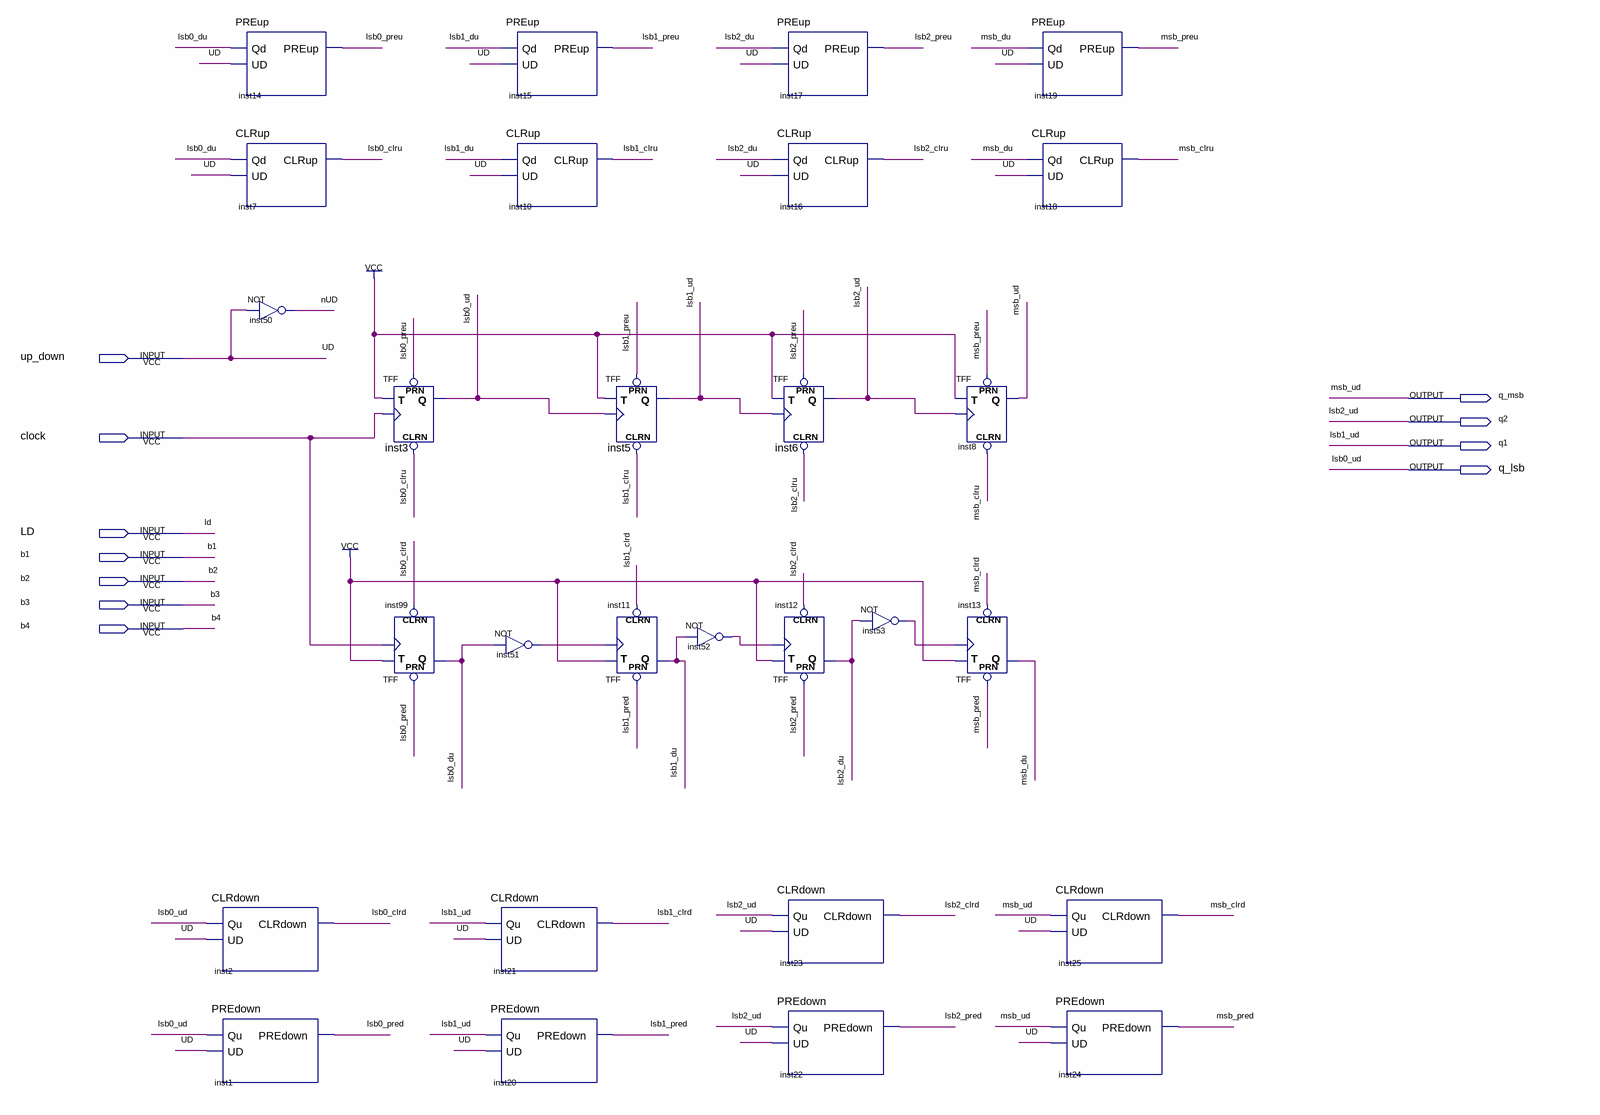
[diagram p0: schematic sheet]
// Quartus schematic up_and_down_counter_box.bdf as structural Verilog: 28 symbols, 11 pins
module up_and_down_counter_box (
  input  up_down,
  input  clock,
  input  LD,
  input  b1,
  input  b2,
  input  b3,
  input  b4,
  output q_msb,
  output q2,
  output q1,
  output q_lsb
);

  wire inst51_out, inst52_out, inst53_out, lsb0_clrd, lsb0_clru, lsb0_du, lsb0_pred, lsb0_preu, lsb1_clrd,
       lsb1_clru, lsb1_du, lsb1_pred, lsb1_preu, lsb2_clrd, lsb2_clru, lsb2_du, lsb2_pred, lsb2_preu,
       msb_clrd, msb_clru, msb_du, msb_pred, msb_preu, nUD;

  CLRdown inst2 (.Qu(q_lsb), .UD(up_down), .CLRdown(lsb0_clrd));
  PREdown inst1 (.Qu(q_lsb), .UD(up_down), .PREdown(lsb0_pred));
  PREup inst14 (.Qd(lsb0_du), .UD(up_down), .PREup(lsb0_preu));
  CLRup inst7 (.Qd(lsb0_du), .UD(up_down), .CLRup(lsb0_clru));
  not inst50 (nUD, up_down);
  TFF inst3 (.PRN(lsb0_preu), .CLRN(lsb0_clru), .T(1'b1), .CLK(clock), .Q(q_lsb));
  TFF inst99 (.PRN(lsb0_pred), .CLRN(lsb0_clrd), .T(1'b1), .CLK(clock), .Q(lsb0_du));
  PREup inst15 (.Qd(lsb1_du), .UD(up_down), .PREup(lsb1_preu));
  CLRup inst10 (.Qd(lsb1_du), .UD(up_down), .CLRup(lsb1_clru));
  not inst51 (inst51_out, lsb0_du);
  CLRdown inst21 (.Qu(q1), .UD(up_down), .CLRdown(lsb1_clrd));
  PREdown inst20 (.Qu(q1), .UD(up_down), .PREdown(lsb1_pred));
  TFF inst5 (.PRN(lsb1_preu), .CLRN(lsb1_clru), .T(1'b1), .CLK(q_lsb), .Q(q1));
  TFF inst11 (.PRN(lsb1_pred), .CLRN(lsb1_clrd), .T(1'b1), .CLK(inst51_out), .Q(lsb1_du));
  not inst52 (inst52_out, lsb1_du);
  PREup inst17 (.Qd(lsb2_du), .UD(up_down), .PREup(lsb2_preu));
  CLRup inst16 (.Qd(lsb2_du), .UD(up_down), .CLRup(lsb2_clru));
  TFF inst6 (.PRN(lsb2_preu), .CLRN(lsb2_clru), .T(1'b1), .CLK(q1), .Q(q2));
  TFF inst12 (.PRN(lsb2_pred), .CLRN(lsb2_clrd), .T(1'b1), .CLK(inst52_out), .Q(lsb2_du));
  CLRdown inst23 (.Qu(q2), .UD(up_down), .CLRdown(lsb2_clrd));
  PREdown inst22 (.Qu(q2), .UD(up_down), .PREdown(lsb2_pred));
  not inst53 (inst53_out, lsb2_du);
  TFF inst8 (.PRN(msb_preu), .CLRN(msb_clru), .T(1'b1), .CLK(q2), .Q(q_msb));
  TFF inst13 (.PRN(msb_pred), .CLRN(msb_clrd), .T(1'b1), .CLK(inst53_out), .Q(msb_du));
  PREup inst19 (.Qd(msb_du), .UD(up_down), .PREup(msb_preu));
  CLRup inst18 (.Qd(msb_du), .UD(up_down), .CLRup(msb_clru));
  CLRdown inst25 (.Qu(q_msb), .UD(up_down), .CLRdown(msb_clrd));
  PREdown inst24 (.Qu(q_msb), .UD(up_down), .PREdown(msb_pred));

  // Other names for the same wires on the sheet: lsb0_ud = q_lsb; lsb1_ud = q1; lsb2_ud = q2; msb_ud = q_msb;
  //   UD = up_down
endmodule
